# Altium schematic sheet Solo Board1.SchDoc
size A4; SheetNumber: 1; SheetTotal: 2
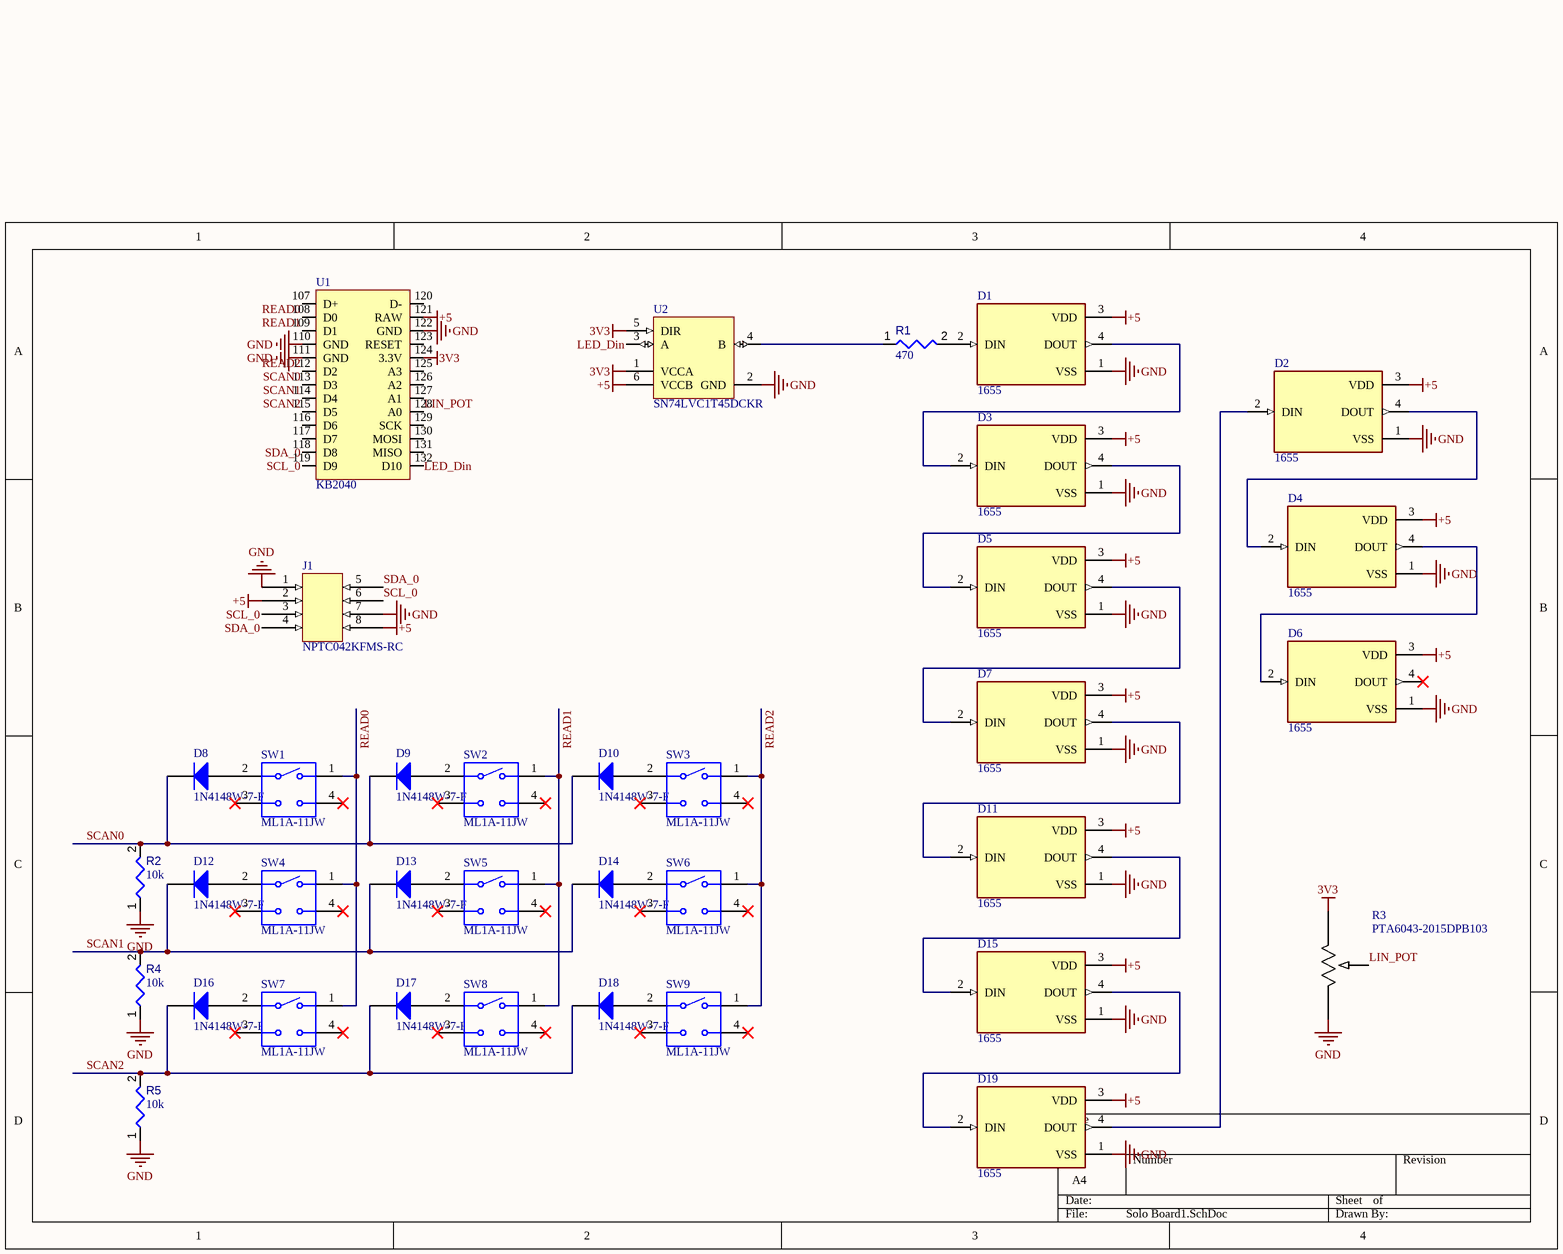
[diagram p0: Solo Board1.SchDoc]

## Parts
D1  1655  [LED_1655]
D2  1655  [LED_1655]
D3  1655  [LED_1655]
D4  1655  [LED_1655]
D5  1655  [LED_1655]
D6  1655  [LED_1655]
D7  1655  [LED_1655]
D8  1N4148W-7-F  [DIOD-SOD123-2_V]
D9  1N4148W-7-F  [DIOD-SOD123-2_V]
D10  1N4148W-7-F  [DIOD-SOD123-2_V]
D11  1655  [LED_1655]
D12  1N4148W-7-F  [DIOD-SOD123-2_V]
D13  1N4148W-7-F  [DIOD-SOD123-2_V]
D14  1N4148W-7-F  [DIOD-SOD123-2_V]
D15  1655  [LED_1655]
D16  1N4148W-7-F  [DIOD-SOD123-2_V]
D17  1N4148W-7-F  [DIOD-SOD123-2_V]
D18  1N4148W-7-F  [DIOD-SOD123-2_V]
D19  1655  [LED_1655]
J1  NPTC042KFMS-RC  [NPTC042KFMS-RC-Footprint-1]
R1  value 470  [RESC0805(2012)_L]  (hidden comment: Resistor 470R +/-5% 0805 125 mW)
R2  value 10k  [RESC2013X50X35ML15T15]  (hidden comment: Resistor 10k +/-1% 0805 125 mW)
R3  PTA6043-2015DPB103  [POT_PTA6043]
R4  value 10k  [RESC2013X50X35ML15T15]  (hidden comment: Resistor 10k +/-1% 0805 125 mW)
R5  value 10k  [RESC2013X50X35ML15T15]  (hidden comment: Resistor 10k +/-1% 0805 125 mW)
SW1  ML1A-11JW  [CHRY-ML1A-11JW_V]
SW2  ML1A-11JW  [CHRY-ML1A-11JW_V]
SW3  ML1A-11JW  [CHRY-ML1A-11JW_V]
SW4  ML1A-11JW  [CHRY-ML1A-11JW_V]
SW5  ML1A-11JW  [CHRY-ML1A-11JW_V]
SW6  ML1A-11JW  [CHRY-ML1A-11JW_V]
SW7  ML1A-11JW  [CHRY-ML1A-11JW_V]
SW8  ML1A-11JW  [CHRY-ML1A-11JW_V]
SW9  ML1A-11JW  [CHRY-ML1A-11JW_V]
U1  KB2040  [KB2040]
U2  SN74LVC1T45DCKR  [DCK0006A_M]

## Nets
3V3: R3.3 U1.124(3.3V) U2.1(VCCA) U2.5(DIR)
+5: D1.3(VDD) D2.3(VDD) D3.3(VDD) D4.3(VDD) D5.3(VDD) D6.3(VDD) D7.3(VDD) D11.3(VDD) D15.3(VDD) D19.3(VDD) J1.2 J1.8 U1.121(RAW) U2.6(VCCB)
GND: D1.1(VSS) D2.1(VSS) D3.1(VSS) D4.1(VSS) D5.1(VSS) D6.1(VSS) D7.1(VSS) D11.1(VSS) D15.1(VSS) D19.1(VSS) J1.1 J1.7 R2.1 R3.1 R4.1 R5.1 U1.110(GND) U1.111(GND) U1.122(GND) U2.2(GND)
LED_Din: U1.132(D10) U2.3(A)
LIN_POT: R3.2 U1.128(A0)
READ0: SW1.1 SW4.1 SW7.1 U1.108(D0)
READ1: SW2.1 SW5.1 SW8.1 U1.109(D1)
READ2: SW3.1 SW6.1 SW9.1 U1.112(D2)
SCAN0: D8.2(K) D9.2(K) D10.2(K) R2.2 U1.113(D3)
SCAN1: D12.2(K) D13.2(K) D14.2(K) R4.2 U1.114(D4)
SCAN2: D16.2(K) D17.2(K) D18.2(K) R5.2 U1.115(D5)
SCL_0: J1.3 J1.6 U1.119(D9)
SDA_0: J1.4 J1.5 U1.118(D8)
NetD1_2: D1.2(DIN) R1.2
NetD1_4: D1.4(DOUT) D3.2(DIN)
NetD2_2: D2.2(DIN) D19.4(DOUT)
NetD2_4: D2.4(DOUT) D4.2(DIN)
NetD3_4: D3.4(DOUT) D5.2(DIN)
NetD4_4: D4.4(DOUT) D6.2(DIN)
NetD5_4: D5.4(DOUT) D7.2(DIN)
NetD7_4: D7.4(DOUT) D11.2(DIN)
NetD8_1: D8.1(A) SW1.2
NetD9_1: D9.1(A) SW2.2
NetD10_1: D10.1(A) SW3.2
NetD11_4: D11.4(DOUT) D15.2(DIN)
NetD12_1: D12.1(A) SW4.2
NetD13_1: D13.1(A) SW5.2
NetD14_1: D14.1(A) SW6.2
NetD15_4: D15.4(DOUT) D19.2(DIN)
NetD16_1: D16.1(A) SW7.2
NetD17_1: D17.1(A) SW8.2
NetD18_1: D18.1(A) SW9.2
NetR1_1: R1.1 U2.4(B)

Not connected (* = marked no-connect by the designer): D6 4(DOUT)*; SW1 3* 4*; SW2 3* 4*; SW3 3* 4*; SW4 3* 4*; SW5 3* 4*; SW6 3* 4*; SW7 3* 4*; SW8 3* 4*; SW9 3* 4*; U1 107(D+) 116(D6) 117(D7) 120(D-) 123(RESET) 125(A3) 126(A2) 127(A1) 129(SCK) 130(MOSI) 131(MISO)

## Library data of the parts
D1-D7 D11 D15 D19 = CMP-004-00031-1: Ws2812b 5050 Rgb Led With Integrated Driver Chip Pack Of 10; Pins: 4; Price: None; MP: 1655; Availability: Unavailable; Value: *; Case/Package: None; Source: 1655.SchLib; Component Type: Standard; Design Item ID: 1655
D8-D10 D12-D14 D16-D18 = CMP-2000-04932-2: Fast Switching Diode, 100 V, 0.15 A, -65 to 150 degC, 2-Pin?SOD123, RoHS, Tape and Reel; Recovery Time: 4ns; Brand: DiodesIncorporated; Unit Weight: 0.000353oz; Max Surge Current: 2A; Peak Reverse Voltage: 100V; Ir - Reverse Current: 1uA; Vf - Forward Voltage: 1.25V; Configuration: Single; If - Forward Current: 0.15A; Product Category: Diodes-GeneralPurpose,Power,Switching; Operating Temperature Range: -65Cto+150C; Packaging: Reel; Manufacturer URL: http://www.diodes.com/; Maximum Operating Temperature: +150C; Height: 1.25mm; Minimum Operating Temperature: -65C; Product: SwitchingDiodes; Package URL: http://www.diodes.com/datasheets/ds18004.pdf; Type: SwitchingDiode; Package Reference: SOD123-2; Width: 1.7mm; Datasheet URL: http://www.farnell.com/datasheets/1915529.pdf; Datasheet Version: Rev. 24-2, 10/2013; Series: 1N4148; Factory Pack Quantity: 3000; Length: 2.85mm; RoHS: True; Manufacturer: DiodesIncorporated; Mounting Style: SMD/SMT; Package / Case: SOD-123
J1 = CMP-002-00071-6: Board Connector, 8 Contact(s), 2 Row(s), Female, Straight, 0.1 inch Pitch, Surface Mount Terminal, Locking; Number Of Connectors: 1; RoHS Compliant: Yes; Connector Type: BOARD CONNECTOR; Mounting Technology: Board
R1 = CMP-009-00122-3: Chip Resistor, 470 Ohms, +/-5%, 125 mW, -55 to 155 degC, 0805; Tolerance: 5%; Power: 125mW; Max Operating Temperature: 155°C; Case/Package: 0805; Pins: 2; Min Operating Temperature: -55°C
R2 R4 R5 = CMP-009-00018-5: Chip Resistor, 10 KOhm, +/- 1%, 125 mW, -55 to 155 degC, 0805 (2012 Metric); Power: 125mW; Voltage Rating: 150V; Tolerance: 1%; Pins: 2; Min Operating Temperature: -55°C; Case/Package: 0805; Max Operating Temperature: 155°C; RoHS Compliant: True; Mounting Technology: SM
R3 = PTA6043-2015DPB103: No Description Available; Mfr_Name: Bourns Electronics
SW1-SW9 = CMP-2000-06718-1: Keyboard Switch, SPST, IP40, 12 V Max, 10 mA Max, -40 to 70 degC, 4-Pin THD, RoHS, Bulk; Manufacturer: Cherry; Part No: ML1A11JW; Illumination Color: N/R; Row Spacing: 10.16mm; Dielectric Strength: 500VAC; Operating Speed: 400mm/s; COO: UK; Body Orientation: Straight; Maximum DC Voltage Rating: 12V; Total Travel: 3mm; Minimum Insulation Resistance: 100MOhm; Maximum Current Rating: 0.01A; Operating Force: 0.45N; Actuator Style: Button; Illumination Type: N/R; Contact Material: Gold/Silver; Package URL: http://cherryamericas.com/wp-content/uploads/2014/12/ml_cat.pdf; Electrical Life: N/A; Dimension: 12x11.4x6.9mm; Actuator Color: N/A; Number of Terminals: 2; Pole Throw Configuration: SPST; Supplier: CherryElectrical; Terminal Type: PCPins; Actuator Material: N/A; IP Rating: IP40; HTS: 8536509065; Package Description: 4-Pin Through Hole Switch, Body 12 x 11.4 mm; Maximum Power Rating: N/A; Mounting: ThroughHole; Mechanical Life: N/A; ECCN: EAR99; Package Reference: ML1A-11JW; Mounting Technology: ThroughHole; Switch Configuration: N/A; Manufacturer URL: http://cherryswitches.com/cn/; RoHS: Unknown; Family: ML; Packaging: N/A; Terminal Pitch: N/R; Maximum AC Voltage Rating: 12V; Datasheet Version: 12/2015; Contact Plating: N/A; Housing Material: N/A; Actuator Length: 3mm; Operating Temperature: -10to70C; Datasheet URL: http://www.cherry.de/PDF/EN_CHERRY_ML1A-xxxx.pdf; Type: N/A
U1 = KB2040: Keyboard IC breakour board; ComponentLink1Description: Datasheet; ComponentLink1URL: https://learn.adafruit.com/adafruit-kb2040/overview
U2 = CMP-0859-00452-3: Single-Bit Dual-Supply Bus Transceiver with Configurable Voltage Translation and 3-State Outputs, DCK0006A, LARGE T&R; Manufacturer: Texas Instruments; Rating: Catalog; Output Type: CMOS; Technology Family: LVC; Voltage(Nom)(V): 1.8,2.5,3.3,5; VCC(Max)(V): 5.5; 3-State Output: Yes; Bits(#): 1; F @ Nom Voltage(Max)(Mhz): 150; VCC(Min)(V): 1.65; ICC @ Nom Voltage(Max)(mA): 0.004; Schmitt Trigger: No; Input Type: CMOS/TTL; tpd @ Nom Voltage(Max)(ns): 15.5,8,5.8,4.4; Logic: True; Output Drive (IOL/IOH)(Max)(mA): 32/-32; Sub-Family: Dual Supply Translator; PackageReference: DCK0006A; Generic Part Number: SN74LVC1T45; DatasheetVersion: SCES515K; Operating Temperature Range(C): -40 to 85